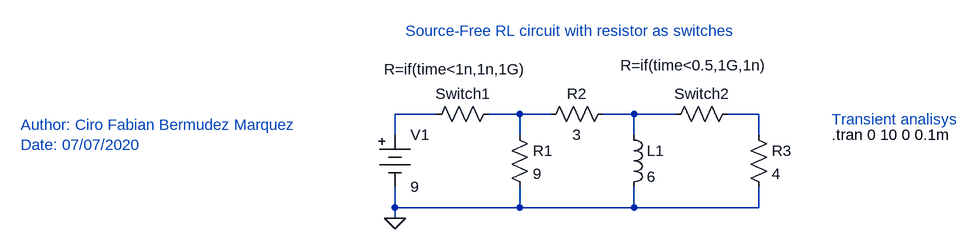
[diagram p0: schematic Source-Free RL_resistor_as_switches.asc]
Source-Free RL_resistor_as_switches.asc, the LTspice schematic file:
Version 4
SHEET 1 880 680
WIRE -96 224 -160 224
WIRE 32 224 -16 224
WIRE 80 224 32 224
WIRE 208 224 160 224
WIRE 272 224 208 224
WIRE 400 224 352 224
WIRE -160 256 -160 224
WIRE 32 256 32 224
WIRE 208 256 208 224
WIRE 400 256 400 224
WIRE -160 368 -160 336
WIRE 32 368 32 336
WIRE 32 368 -160 368
WIRE 208 368 208 336
WIRE 208 368 32 368
WIRE 400 368 400 336
WIRE 400 368 208 368
WIRE -160 384 -160 368
FLAG -160 384 0
SYMBOL Misc\\battery -160 240 R0
WINDOW 123 0 0 Left 0
WINDOW 39 0 0 Left 0
SYMATTR InstName V1
SYMATTR Value 9
SYMBOL res -112 240 R270
WINDOW 0 32 56 VTop 2
WINDOW 3 101 45 VBottom 2
SYMATTR InstName Switch1
SYMATTR Value R=if(time<1n,1n,1G)
SYMBOL res 64 240 R270
WINDOW 0 32 56 VTop 2
WINDOW 3 0 56 VBottom 2
SYMATTR InstName R2
SYMATTR Value 3
SYMBOL res 256 240 R270
WINDOW 0 32 56 VTop 2
WINDOW 3 107 44 VBottom 2
SYMATTR InstName Switch2
SYMATTR Value R=if(time<0.5,1G,1n)
SYMBOL res 16 240 R0
SYMATTR InstName R1
SYMATTR Value 9
SYMBOL res 384 240 R0
SYMATTR InstName R3
SYMATTR Value 4
SYMBOL ind 192 240 R0
SYMATTR InstName L1
SYMATTR Value 6
TEXT 512 256 Left 2 !.tran 0 10 0 0.1m
TEXT -144 96 Left 2 ;Source-Free RL circuit with resistor as switches
TEXT 512 232 Left 2 ;Transient analisys
TEXT -736 240 Left 2 ;Author: Ciro Fabian Bermudez Marquez\nDate: 07/07/2020

The netlist it stands for:
* Source-Free RL_resistor_as_switches.asc
V1 N001 0 9
R§Switch1 N001 N002 R=if(time<1n,1n,1G)
R2 N002 N003 3
R§Switch2 N003 N004 R=if(time<0.5,1G,1n)
R1 N002 0 9
R3 N004 0 4
L1 N003 0 6
.tran 0 10 0 0.1m
* Source-Free RL circuit with resistor as switches
* Transient analisys
* Author: Ciro Fabian Bermudez Marquez
* Date: 07/07/2020
.backanno
.end